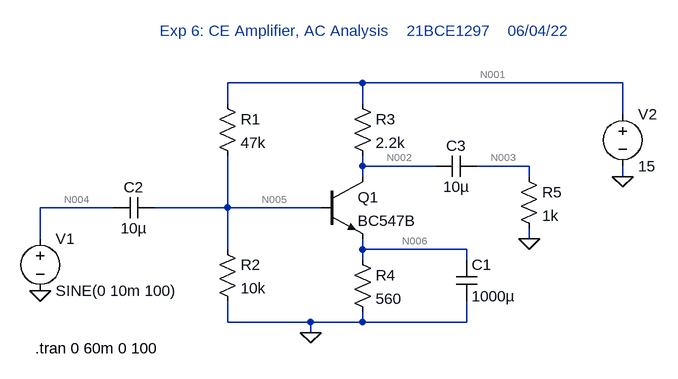
[diagram p0: schematic Exp6_1.asc]
Exp6_1.asc, the LTspice schematic file:
Version 4
SHEET 1 880 680
WIRE 112 128 -96 128
WIRE 512 128 112 128
WIRE -96 160 -96 128
WIRE 112 160 112 128
WIRE 512 176 512 128
WIRE 112 256 112 240
WIRE 224 256 112 256
WIRE 368 256 288 256
WIRE 112 272 112 256
WIRE 368 272 368 256
WIRE 512 272 512 256
WIRE -272 320 -384 320
WIRE -96 320 -96 240
WIRE -96 320 -208 320
WIRE 48 320 -96 320
WIRE -384 368 -384 320
WIRE 368 368 368 352
WIRE -96 384 -96 320
WIRE 112 384 112 368
WIRE 272 384 112 384
WIRE 112 400 112 384
WIRE 272 400 272 384
WIRE -96 496 -96 464
WIRE 32 496 -96 496
WIRE 112 496 112 480
WIRE 112 496 32 496
WIRE 272 496 272 464
WIRE 272 496 112 496
WIRE 32 512 32 496
FLAG -384 448 0
FLAG 368 368 0
FLAG 32 512 0
FLAG 512 272 0
SYMBOL npn 48 272 R0
SYMATTR InstName Q1
SYMATTR Value BC547B
SYMBOL res -112 144 R0
SYMATTR InstName R1
SYMATTR Value 47k
SYMBOL res -112 368 R0
SYMATTR InstName R2
SYMATTR Value 10k
SYMBOL res 96 144 R0
SYMATTR InstName R3
SYMATTR Value 2.2k
SYMBOL res 96 384 R0
SYMATTR InstName R4
SYMATTR Value 560
SYMBOL res 352 256 R0
SYMATTR InstName R5
SYMATTR Value 1k
SYMBOL voltage -384 352 R0
WINDOW 123 0 0 Left 0
WINDOW 39 0 0 Left 0
SYMATTR InstName V1
SYMATTR Value SINE(0 10m 100)
SYMBOL voltage 512 160 R0
SYMATTR InstName V2
SYMATTR Value 15
SYMBOL cap 256 400 R0
SYMATTR InstName C1
SYMATTR Value 1000µ
SYMBOL cap -208 304 R90
WINDOW 0 0 32 VBottom 2
WINDOW 3 32 32 VTop 2
SYMATTR InstName C2
SYMATTR Value 10µ
SYMBOL cap 288 240 R90
WINDOW 0 0 32 VBottom 2
WINDOW 3 32 32 VTop 2
SYMATTR InstName C3
SYMATTR Value 10µ
TEXT -200 48 Left 2 ;Exp 6: CE Amplifier, AC Analysis    21BCE1297    06/04/22
TEXT -392 536 Left 2 !.tran 0 60m 0 100

The netlist it stands for:
* Exp6_1.asc
Q1 N002 N005 N006 0 BC547B
R1 N001 N005 47k
R2 N005 0 10k
R3 N001 N002 2.2k
R4 N006 0 560
R5 N003 0 1k
V1 N004 0 SINE(0 10m 100)
V2 N001 0 15
C1 N006 0 1000µ
C2 N005 N004 10µ
C3 N003 N002 10µ
.model NPN NPN
.model PNP PNP
.lib standard.bjt
* Exp 6: CE Amplifier, AC Analysis    21BCE1297    06/04/22
.tran 0 60m 0 100
.backanno
.end

* Results of the author's LTspice run, read from the files saved beside the schematic
* Operating Point, zero values left out:
*   V(n002) = 7.675 V
*   V(n005) = 2.541 V
*   V(n006) = 1.871 V
*   V(n001) = 15 V
*   Ic(Q1) = 3.33 mA
*   Ib(Q1) = 11.04 µA
*   Ie(Q1) = -3.341 mA
*   I(R4) = 3.341 mA
*   I(R3) = 3.33 mA
*   I(R2) = 254.1 µA
*   I(R1) = 265.1 µA
*   I(V2) = -3.595 mA
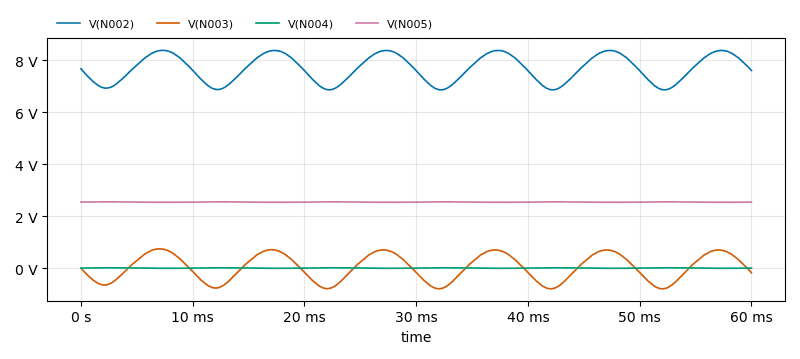
[diagram p1: Transient Analysis of Exp6_1.asc, plotted from the saved traces]
* Transient Analysis, 1 run:
*   V(N002): min 6.865 V, max 8.385 V, average 7.674 V, rms 7.693 V, last 7.608 V
*   V(N003): min -799 mV, max 738.4 mV, average 14.53 mV, rms 521.2 mV, last -179.6 mV
*   V(N004): min -9.995 mV, max 9.995 mV, average 928.8 nV, rms 7.183 mV, last 0 V
*   V(N005): min 2.53 V, max 2.55 V, average 2.54 V, rms 2.54 V, last 2.541 V